# Altium schematic sheet FinalBoard.SchDoc
size E
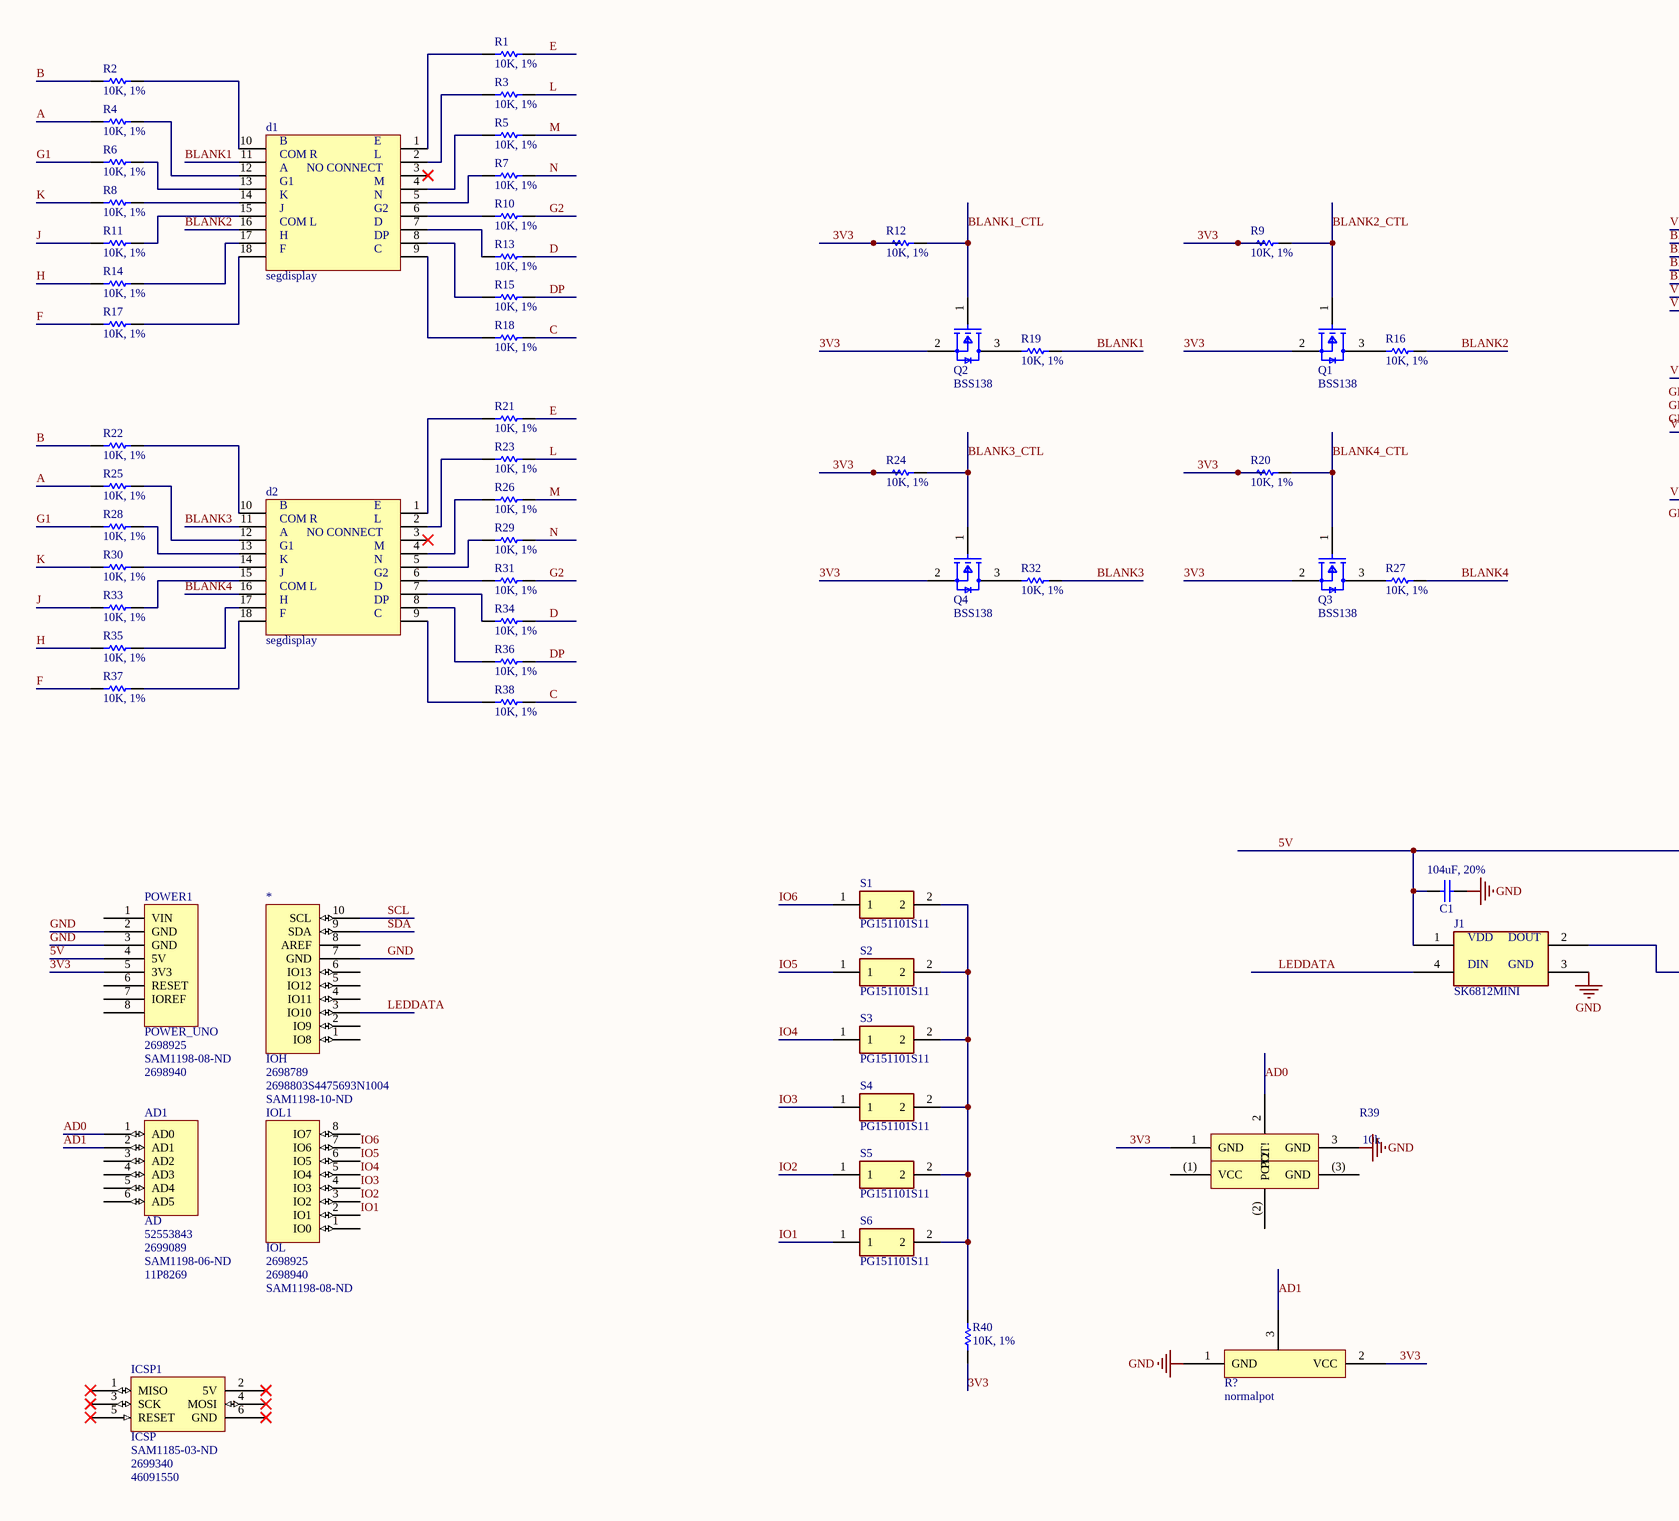
[diagram p0: FinalBoard.SchDoc, left]
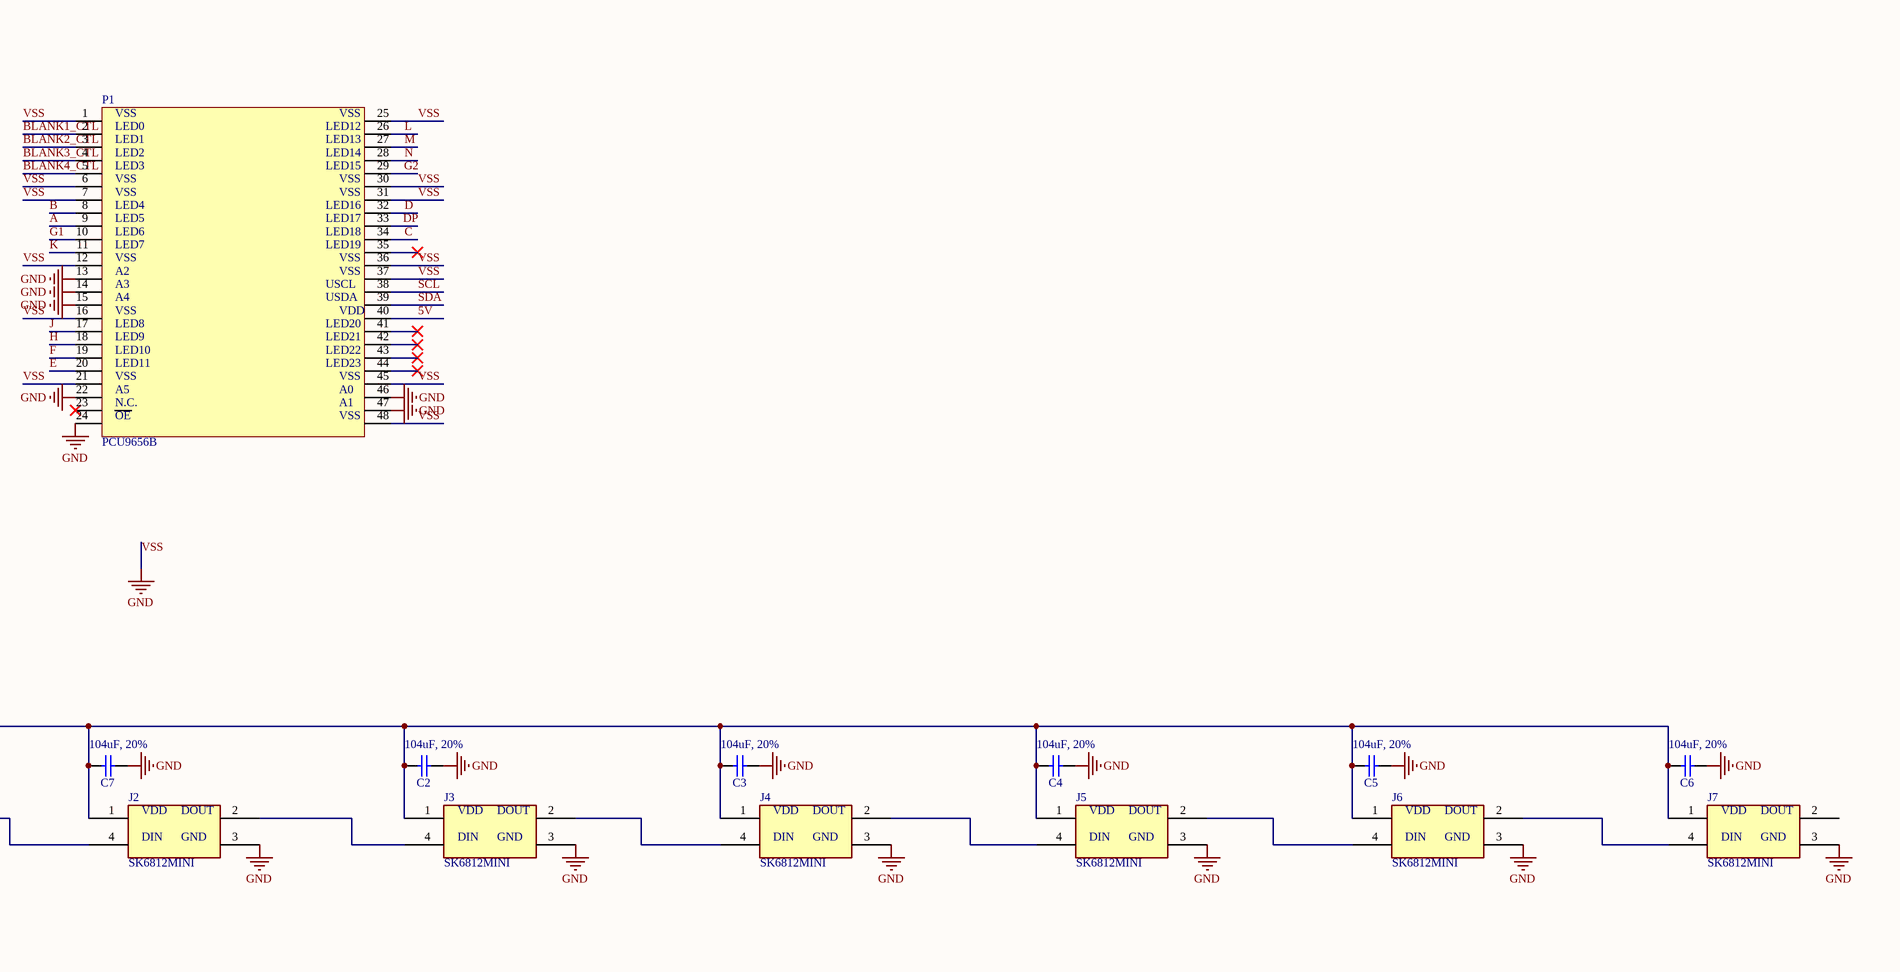
[diagram p1: FinalBoard.SchDoc, right]

## Parts
*  IOH  Supplier Part Number 1: 2698789  Supplier Part Number 2: 2698803S4475693N1004  Supplier Part Number 3: SAM1198-10-ND  [Header 10x1 8.5mm]
AD1  AD  Supplier Part Number 1: 52553843  Supplier Part Number 2: 2699089  Supplier Part Number 3: SAM1198-06-ND  Supplier Part Number 4: 11P8269  [Header 6x1 8.5mm]
C1  104uF, 20%  [0805_CAP_HD]
C2  104uF, 20%  [0805_CAP_HD]
C3  104uF, 20%  [0805_CAP_HD]
C4  104uF, 20%  [0805_CAP_HD]
C5  104uF, 20%  [0805_CAP_HD]
C6  104uF, 20%  [0805_CAP_HD]
C7  104uF, 20%  [0805_CAP_HD]
d1  segdisplay  [PCBComponent_1]
d2  segdisplay  [PCBComponent_1]
ICSP1  ICSP  Supplier Part Number 1: SAM1185-03-ND  Supplier Part Number 2: 2699340  Supplier Part Number 3: 46091550  [ICSP]
IOL1  IOL  Supplier Part Number 1: 2698925  Supplier Part Number 2: 2698940  Supplier Part Number 3: SAM1198-08-ND  [Header 8x1 8.5mm]
J1  SK6812MINI  [LED-3535]
J2  SK6812MINI  [LED-3535]
J3  SK6812MINI  [LED-3535]
J4  SK6812MINI  [LED-3535]
J5  SK6812MINI  [LED-3535]
J6  SK6812MINI  [LED-3535]
J7  SK6812MINI  [LED-3535]
P1  PCU9656B  [QFP50P900X900X160-48N]
POWER1  POWER_UNO  Supplier Part Number 1: 2698925  Supplier Part Number 2: SAM1198-08-ND  Supplier Part Number 3: 2698940  [Header 8x1 8.5mm]
Q1  BSS138  [FP-318-08-IPC_B]
Q2  BSS138  [FP-318-08-IPC_B]
Q3  BSS138  [FP-318-08-IPC_B]
Q4  BSS138  [FP-318-08-IPC_B]
R1  10K, 1%  [0603_RES_HD]
R2  10K, 1%  [0603_RES_HD]
R3  10K, 1%  [0603_RES_HD]
R4  10K, 1%  [0603_RES_HD]
R5  10K, 1%  [0603_RES_HD]
R6  10K, 1%  [0603_RES_HD]
R7  10K, 1%  [0603_RES_HD]
R8  10K, 1%  [0603_RES_HD]
R9  10K, 1%  [0603_RES_HD]
R10  10K, 1%  [0603_RES_HD]
R11  10K, 1%  [0603_RES_HD]
R12  10K, 1%  [0603_RES_HD]
R13  10K, 1%  [0603_RES_HD]
R14  10K, 1%  [0603_RES_HD]
R15  10K, 1%  [0603_RES_HD]
R16  10K, 1%  [0603_RES_HD]
R17  10K, 1%  [0603_RES_HD]
R18  10K, 1%  [0603_RES_HD]
R19  10K, 1%  [0603_RES_HD]
R20  10K, 1%  [0603_RES_HD]
R21  10K, 1%  [0603_RES_HD]
R22  10K, 1%  [0603_RES_HD]
R23  10K, 1%  [0603_RES_HD]
R24  10K, 1%  [0603_RES_HD]
R25  10K, 1%  [0603_RES_HD]
R26  10K, 1%  [0603_RES_HD]
R27  10K, 1%  [0603_RES_HD]
R28  10K, 1%  [0603_RES_HD]
R29  10K, 1%  [0603_RES_HD]
R30  10K, 1%  [0603_RES_HD]
R31  10K, 1%  [0603_RES_HD]
R32  10K, 1%  [0603_RES_HD]
R33  10K, 1%  [0603_RES_HD]
R34  10K, 1%  [0603_RES_HD]
R35  10K, 1%  [0603_RES_HD]
R36  10K, 1%  [0603_RES_HD]
R37  10K, 1%  [0603_RES_HD]
R38  10K, 1%  [0603_RES_HD]
R39  10k  [sliderpot]
R40  10K, 1%  [0603_RES_HD]
R?  normalpot  [normalpot]
S1  PG151101S11  [SW_PG151101S11]
S2  PG151101S11  [SW_PG151101S11]
S3  PG151101S11  [SW_PG151101S11]
S4  PG151101S11  [SW_PG151101S11]
S5  PG151101S11  [SW_PG151101S11]
S6  PG151101S11  [SW_PG151101S11]

## Nets
GND: *.7(GND) C1.2 C2.2 C3.2 C4.2 C5.2 C6.2 C7.2 J1.3(GND) J2.3(GND) J3.3(GND) J4.3(GND) J5.3(GND) J6.3(GND) J7.3(GND) P1.1 P1.6 P1.7 P1.12 P1.13 P1.14 P1.15 P1.16 P1.21 P1.22 P1.24 P1.25 P1.30 P1.31 P1.36 P1.37 P1.45 P1.46 P1.47 P1.48 POWER1.2(GND) POWER1.3(GND) R39.3(GND) R?.1(GND)  [also labelled VSS]
3V3: POWER1.5(3V3) Q1.2(S) Q2.2(S) Q3.2(S) Q4.2(S) R9.1 R12.1 R20.1 R24.1 R39.1(GND) R40.1 R?.2(VCC)
5V: C1.1 C2.1 C3.1 C4.1 C5.1 C6.1 C7.1 J1.1(VDD) J2.1(VDD) J3.1(VDD) J4.1(VDD) J5.1(VDD) J6.1(VDD) J7.1(VDD) P1.40 POWER1.4(5V)
A: P1.9 R4.1 R25.1
AD0: AD1.1(AD0) R39.2(POT!)
AD1: AD1.2(AD1) R?.3(OUT)
B: P1.8 R2.1 R22.1
BLANK1: d1.11 R19.2
BLANK1_CTL: P1.2 Q2.1(G) R12.2
BLANK2: d1.16 R16.2
BLANK2_CTL: P1.3 Q1.1(G) R9.2
BLANK3: d2.11 R32.2
BLANK3_CTL: P1.4 Q4.1(G) R24.2
BLANK4: d2.16 R27.2
BLANK4_CTL: P1.5 Q3.1(G) R20.2
C: P1.34 R18.2 R38.2
D: P1.32 R13.2 R34.2
DP: P1.33 R15.2 R36.2
E: P1.20 R1.2 R21.2
F: P1.19 R17.1 R37.1
G1: P1.10 R6.1 R28.1
G2: P1.29 R10.2 R31.2
H: P1.18 R14.1 R35.1
IO1: IOL1.2(IO1) S6.1
IO2: IOL1.3(IO2) S5.1
IO3: IOL1.4(IO3) S4.1
IO4: IOL1.5(IO4) S3.1
IO5: IOL1.6(IO5) S2.1
IO6: IOL1.7(IO6) S1.1
J: P1.17 R11.1 R33.1
K: P1.11 R8.1 R30.1
L: P1.26 R3.2 R23.2
LEDDATA: *.3(IO10) J1.4(DIN)
M: P1.27 R5.2 R26.2
N: P1.28 R7.2 R29.2
SCL: *.10(SCL) P1.38
SDA: *.9(SDA) P1.39
Netd1_1: d1.1 R1.1
Netd1_2: d1.2 R3.1
Netd1_4: d1.4 R5.1
Netd1_5: d1.5 R7.1
Netd1_6: d1.6 R10.1
Netd1_7: d1.7 R13.1
Netd1_8: d1.8 R15.1
Netd1_9: d1.9 R18.1
Netd1_10: d1.10 R2.2
Netd1_12: d1.12 R4.2
Netd1_13: d1.13 R6.2
Netd1_14: d1.14 R8.2
Netd1_15: d1.15 R11.2
Netd1_17: d1.17 R14.2
Netd1_18: d1.18 R17.2
Netd2_1: d2.1 R21.1
Netd2_2: d2.2 R23.1
Netd2_4: d2.4 R26.1
Netd2_5: d2.5 R29.1
Netd2_6: d2.6 R31.1
Netd2_7: d2.7 R34.1
Netd2_8: d2.8 R36.1
Netd2_9: d2.9 R38.1
Netd2_10: d2.10 R22.2
Netd2_12: d2.12 R25.2
Netd2_13: d2.13 R28.2
Netd2_14: d2.14 R30.2
Netd2_15: d2.15 R33.2
Netd2_17: d2.17 R35.2
Netd2_18: d2.18 R37.2
NetJ1_2: J1.2(DOUT) J2.4(DIN)
NetJ2_2: J2.2(DOUT) J3.4(DIN)
NetJ3_2: J3.2(DOUT) J4.4(DIN)
NetJ4_2: J4.2(DOUT) J5.4(DIN)
NetJ5_2: J5.2(DOUT) J6.4(DIN)
NetJ6_2: J6.2(DOUT) J7.4(DIN)
NetQ1_3: Q1.3(D) R16.1
NetQ2_3: Q2.3(D) R19.1
NetQ3_3: Q3.3(D) R27.1
NetQ4_3: Q4.3(D) R32.1
NetR40_2: R40.2 S1.2 S2.2 S3.2 S4.2 S5.2 S6.2

Not connected (* = marked no-connect by the designer): * 1(IO8) 2(IO9) 4(IO11) 5(IO12) 6(IO13) 8(AREF); AD1 3(AD2) 4(AD3) 5(AD4) 6(AD5); d1 3*; d2 3*; ICSP1 1(MISO)* 2(5V)* 3(SCK)* 4(MOSI)* 5(RESET)* 6(GND)*; IOL1 1(IO0) 8(IO7); J7 2(DOUT); P1 23* 35* 41* 42* 43* 44*; POWER1 1(VIN) 6(RESET) 7(IOREF) 8; R39 (1)(VCC) (2)(POT2) (3)(GND)

## Notes on the sheet
- (in symbol PCU9656B) VSS; LED0; LED12; LED1; LED13; LED2; LED14; LED3; LED15; LED4; LED16; LED5; LED17; LED6; LED18; LED7; LED19; A2; A3; USCL; A4; USDA; VDD; LED8; LED20; LED9; LED21; LED10; LED22; LED11; LED23; A5; A0; N.C.; A1; OE
- (in symbol segdisplay) B; E; COM R; L; A; NO CONNECT; G1; M; K; N; J; G2; COM L; D; H; DP; F; C

## Library data of the parts
C1-C7 = 08056D226MAT2A: 22uF, 20%, 6.3V; Manufacturer 1: AVX; GFUPartNo: 08056D226MAT2A; Manufacturer Part Number 1: 08056D226MAT2A; Part Type: SMT; PackageReference: 0805; Supplier 1: Digi-Key; Supplier Part Number 1: 478-3647-1-ND
J1-J7 = SK6812MINI: INTEGRATED LIGHT SOURCE INTELLIGENT CONTROL OF CHIP-ON-TOP SMD TYPE LED; MF: DONGGUANG OPSCO OPTOELECTRONICS CO., LTD; Check_prices: https://www.snapeda.com/parts/SK6812MINI/DONGGUANG+OPSCO+OPTOELECTRONICS+CO.%252C+LTD/view-part/?ref=eda; MP: SK6812MINI; Package: Package; Price: None; Availability: Not in stock; SnapEDA_Link: https://www.snapeda.com/parts/SK6812MINI/DONGGUANG+OPSCO+OPTOELECTRONICS+CO.%252C+LTD/view-part/?ref=snap; Value: *
Q1-Q4 = CMP-07173-000101-1: MOSFET N-CH 50V 220MA SOT-23; Turn-Off Delay Time: 20ns; Element Configuration: Single; Rds On Max: 3.5R; Gate to Source Voltage (Vgs): 20V; Threshold Voltage: 1.3V; Number of Elements: 1; Power Dissipation: 360mW; Rise Time: 9ns; Turn-On Delay Time: 2.5ns; Input Capacitance: 27pF; On-State Resistance: 6R; Lead Free: Lead Free; Length: 2.92mm; Width: 1.3mm; Drain to Source Breakdown Voltage: 50V; Min Operating Temperature: -55°C; REACH SVHC: No SVHC; Packaging: Tape and Reel; Radiation Hardening: No; Height: 0.93mm; Drain to Source Voltage (Vdss): 50V; Current Rating: 220mA; Voltage Rating (DC): 50V; Weight: 0.03g; Continuous Drain Current (ID): 220mA; Number of Pins: 3; Nominal Vgs: 1.3V; Max Power Dissipation: 360mW; Fall Time: 9ns; Drain to Source Resistance: 3.5R; Contact Plating: Tin; Case/Package: SOT-23; Package Quantity: 1; Dual Supply Voltage: 50V; Mount: Surface Mount; Termination: SMD/SMT; Max Operating Temperature: 150°C
R1-R38 R40 = CRCW060316K5FKEA: RES 16.5K OHM 1/10W 1% 0603 SMD; Manufacturer 1: Vishay; GFUPartNo: CRCW060316K5FKEA; Manufacturer Part Number 1: CRCW060316K5FKEA; Part Type: SMT; Supplier 1: Digi-Key; Supplier Part Number 1: 541-16.5KHCT-ND
R39 = sliderpot
S1-S6 = PG151101S11: Keyswitch; MF: Kailh; SnapEDA_Link: https://www.snapeda.com/parts/PG151101S11/Kailh/view-part/4218555/?ref=snap; Price: None; MP: PG151101S11; Availability: Unavailable; Value: *; Package: Package
* = IOH: Supplier 1: Arrow; Supplier 2: Arrow; Supplier 3: Digi-Key
AD1 = AD: Supplier 1: Arrow; Supplier 2: Arrow; Supplier 3: Digi-Key; Supplier 4: Newark
ICSP1 = ICSP: Supplier 1: Digi-Key; Supplier 2: Arrow; Supplier 3: Arrow
IOL1 = IOL: Supplier 1: Arrow; Supplier 2: Arrow; Supplier 3: Digi-Key
POWER1 = POWER_UNO: Supplier 1: Arrow; Supplier 2: Digi-Key; Supplier 3: Arrow